# Altium schematic sheet Current Mirror_1.SchDoc
size A4; SheetNumber: 3; SheetTotal: 4; SPICEModelCacheHRDDRHZG: <root> / <DocumentId>HRDDRHZG</DocumentId> / </root>
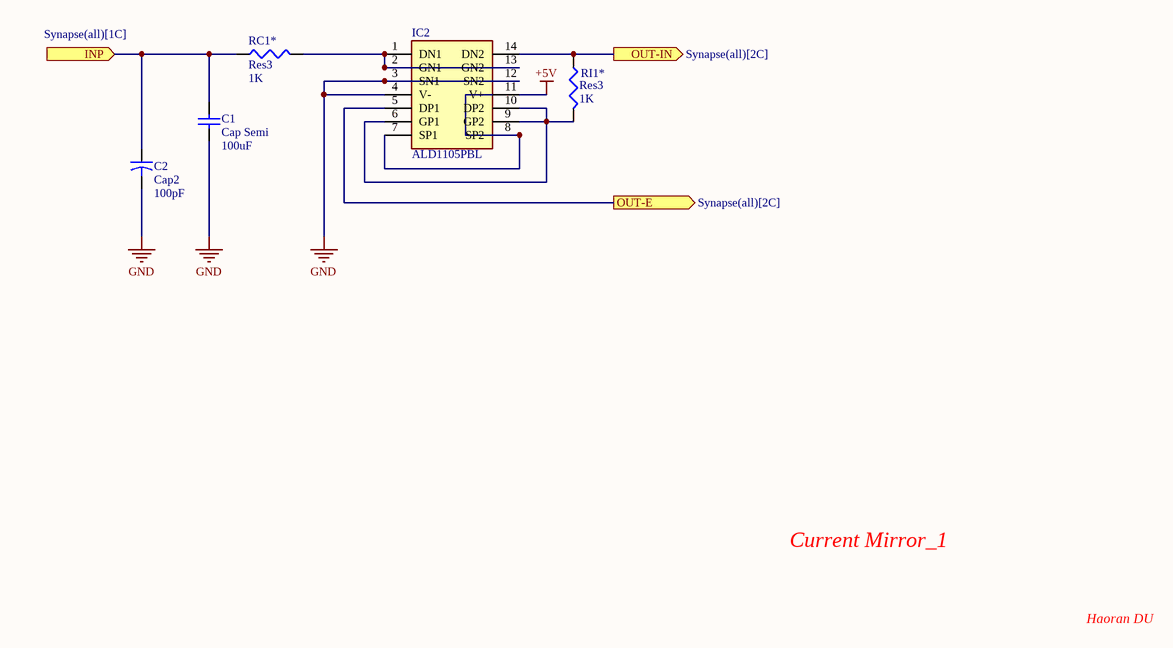
[diagram p0: Current Mirror_1.SchDoc]

## Parts
C1  Cap Semi  value 100uF  [C1206]
C2  Cap2  value 100pF  [CAPR5-4X5]
IC2  ALD1105PBL  [DIP762W51P254L1828H508Q14N]
RC1*  Res3  value 1K  [J1-0603]
RI1*  Res3  value 1K  [J1-0603]

## Ports
INP (in, see Synapse(all)[1C]), OUT-E (out, see Synapse(all)[2C]), OUT-IN (out, see Synapse(all)[2C])

## Nets
+5V: IC2.11(V+)
GND: C1.1 C2.2 IC2.3(SN1) IC2.4(V-) IC2.12(SN2)
INP: C1.2 C2.1 RC1*.1 ; port INP
OUT-E: IC2.5(DP1) ; port OUT-E
OUT-IN: IC2.14(DN2) RI1*.1 ; port OUT-IN
NetIC2_1: IC2.1(DN1) IC2.2(GN1) IC2.13(GN2) RC1*.2
NetIC2_6: IC2.6(GP1) IC2.9(GP2) IC2.10(DP2) RI1*.2
NetIC2_7: IC2.7(SP1) IC2.8(SP2)

## Notes on the sheet
- Current Mirror_1
- Haoran DU

## Library data of the parts
C1 = Cap Semi: Capacitor (Semiconductor SIM Model); Published: 8-Jun-2000; LatestRevisionDate: 29-May-2009; LatestRevisionNote: IPC-7351 Footprint Added.; PackageReference: C1206; Publisher: Altium Limited; PackageDescription: Chip Capacitor
C2 = Cap2: Capacitor; Published: 23-Sep-2002; PackageReference: CAPR5-4X5; Publisher: Altium Limited; PackageDescription: Capacitor; 2 Leads
IC2 = ALD1105PBL: Integrated Circuit; Manufacturer_Name: Advanced Linear Devices Inc.; Datasheet Link: https://www.mouser.es/datasheet/2/8/ALD1105-963896.pdf; Height: 5.08mm; Manufacturer_Part_Number: ALD1105PBL; Mouser Part Number: 585-ALD1105PBL; Mouser Price/Stock: https://www.mouser.co.uk/ProductDetail/Advanced-Linear-Devices/ALD1105PBL?qs=Du6x3Vjr3lUq%2FSLBVb98Ng%3D%3D
RC1* RI1* = Res3: Resistor; Published: 8-Jun-2000; LatestRevisionDate: 29-May-2009; LatestRevisionNote: IPC-7351 Footprint Added.; PackageReference: J1-0603; Publisher: Altium Limited; PackageDescription: Chip Resistor